# EAGLE design sesame_revA (EAGLE 8.0.0)
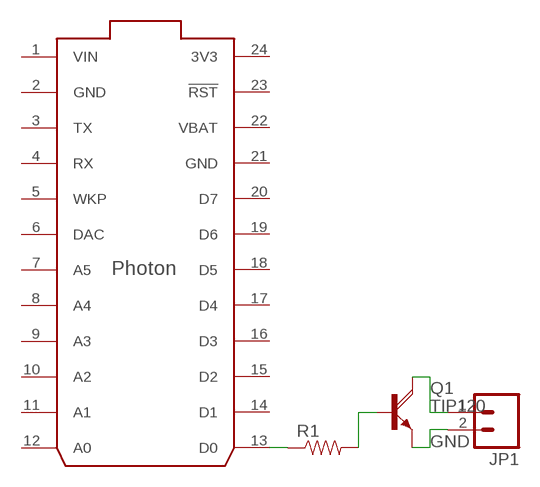
[diagram p0: schematic, sheet 1]

## Parts
JP1  M02POLAR  [MOLEX-1X2]
Q1  TIP120  [TO220AH]
R1  RESISTORPTH-1/4W  [AXIAL-0.4]
U$1  PHOTON_WITH_HEADERS  [PHOTON]

## Nets
GND: JP1.2 Q1.E
N$1: JP1.1 Q1.C
N$2: Q1.B R1.P$2
N$4: R1.P$1 U$1.13(D0)
Unconnected: U$1.3(TX) U$1.4(RX) U$1.5(WKP) U$1.6(DAC) U$1.7(A5) U$1.8(A4) U$1.9(A3) U$1.10(A2) U$1.11(A1) U$1.12(A0) U$1.14(D1) U$1.15(D2) U$1.16(D3) U$1.17(D4) U$1.18(D5) U$1.19(D6) U$1.20(D7) U$1.23(!RST)

## Power pins joined to a net without a drawn wire
3V3: U$1.24(3V3)
GND: U$1.2(GND) U$1.21(GND)
VBAT: U$1.22(VBAT)
VIN: U$1.1(VIN)

## Library data of the parts
JP1 = SparkFun-Connectors:M02: Standard 2-pin 0.1" header. Use with - straight break away headers ( PRT-00116) - right angle break away headers (PRT-00553) - swiss pins (PRT-00743) - machine pins (PRT-00117) - female headers (PRT-00115) Molex polarized connector foot print use with: PRT-08233 with associated crimp pins and housings. 2.54_SCREWTERM for use with PRT-10571. 3.5mm Screw Terminal footprints for PRT-08084 5mm Screw Terminal footprints for use with PRT-08432
Q1 = transistor-power:TIP120: NPN DARLINGTON TRANSISTOR
R1 = SparkFun-Passives:RESISTOR: Resistor Basic schematic elements and footprints for 0603, 1206, and PTH resistors.
U$1 = Particle:PHOTON

## Board
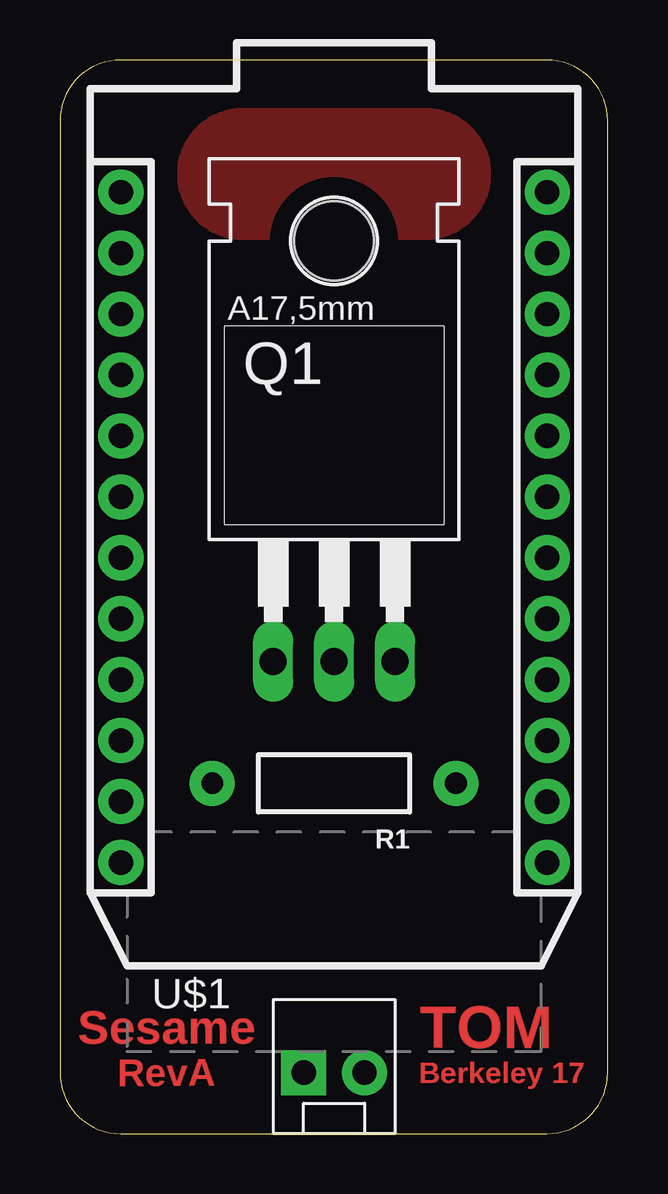
[diagram p1: board, top side]
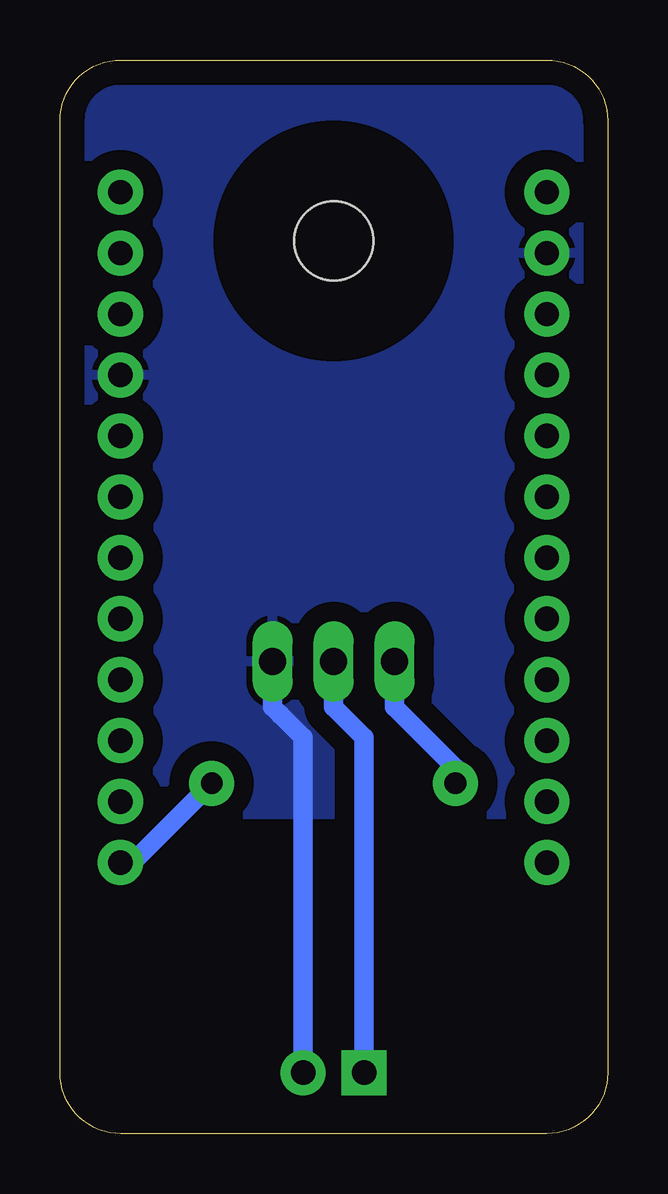
[diagram p2: board, bottom side, seen from below]

Size 22.84 x 44.75 mm. Coordinates in mm from the lower left corner, seen from the top.
Outline: 22.84,2.54 22.84,42.22 arc90 20.3,44.75 2.54,44.75 arc90 0,42.22 0,2.54 arc90 2.54,0 20.3,0 arc90 22.84,2.54
Copper layers (1*16): Top 0.035mm / dielectric 1.5mm / Bottom 0.035mm
Design rules "default": minimum track width 10mil, minimum drill 24mil, track to track 8mil, track to pad 8mil, pad to pad 8mil, via to via 8mil, smd to smd 8mil, copper to edge 40mil, drill to drill 8mil, minimum pad ring 10mil, minimum via ring 8mil, stop-mask expansion 4mil, vias tented up to drill 0mil, thermal gap 10mil

### Footprints (pad centres in the part's own frame; a part is rotated, then mirrored left to right if it is on the bottom)
MOLEX-1X2 = drill 1.016 pad 1.88 square: 1 0,0 | drill 1.016 pad 1.88: 2 2.54,0
TO220AH = drill 1.118 long: B -2.54,-6.35; C 0,-6.35; E 2.54,-6.35 | hole 3.302: 0,11.176
AXIAL-0.4 = drill 0.9 pad 1.88: P$1 -5.08,0; P$2 5.08,0
PHOTON = drill 1.016 pad 1.88: 1 1.27,32.258; 2 1.27,29.718; 3 1.27,27.178; 4 1.27,24.638; 5 1.27,22.098; 6 1.27,19.558; 7 1.27,17.018; 8 1.27,14.478; 9 1.27,11.938; 10 1.27,9.398; 11 1.27,6.858; 12 1.27,4.318; 13 19.05,4.318; 14 19.05,6.858; 15 19.05,9.398; 16 19.05,11.938; 17 19.05,14.478; 18 19.05,17.018; 19 19.05,19.558; 20 19.05,22.098; 21 19.05,24.638; 22 19.05,27.178; 23 19.05,29.718; 24 19.05,32.258

### Placement (x,y rotation side)
JP1  10.16,2.54 0 top
Q1  11.43,26.04 0 top
R1  11.43,14.61 180 top
U$1  1.27,6.98 0 top

### Tracks (layer width: path | path; a pad name or v marks a point on that pad's centre or on a via)
GND
  Bottom 0.813: Q1.E 13.97,17.78 13.65,17.46 | 12.7,16.51 13.65,17.46 | JP1.2 12.7,16.51 | 12.7,16.51 13.65,17.46
  pour Bottom (isolate 0.813): -1.27,46.36 24.13,46.36 24.13,13.34 -1.27,13.34
N$1
  Bottom 0.813: Q1.C 11.43,17.78 10.16,16.51 JP1.1
N$2
  Bottom 0.813: Q1.B 8.89,17.78 6.35,15.24 R1.P$2
N$4
  Bottom 0.813: U$1.13 19.81,11.3 R1.P$1
NC
  pour Top: 7.62,37.47 15.24,37.47 arc90 17.78,40 arc90 15.24,42.55 7.62,42.55 arc90 5.08,40 arc90

### Text on the board
Top: Sesame | TOM | RevA | Berkeley 17